# EAGLE design Rainbowduino_v2.0 (EAGLE 5.06)
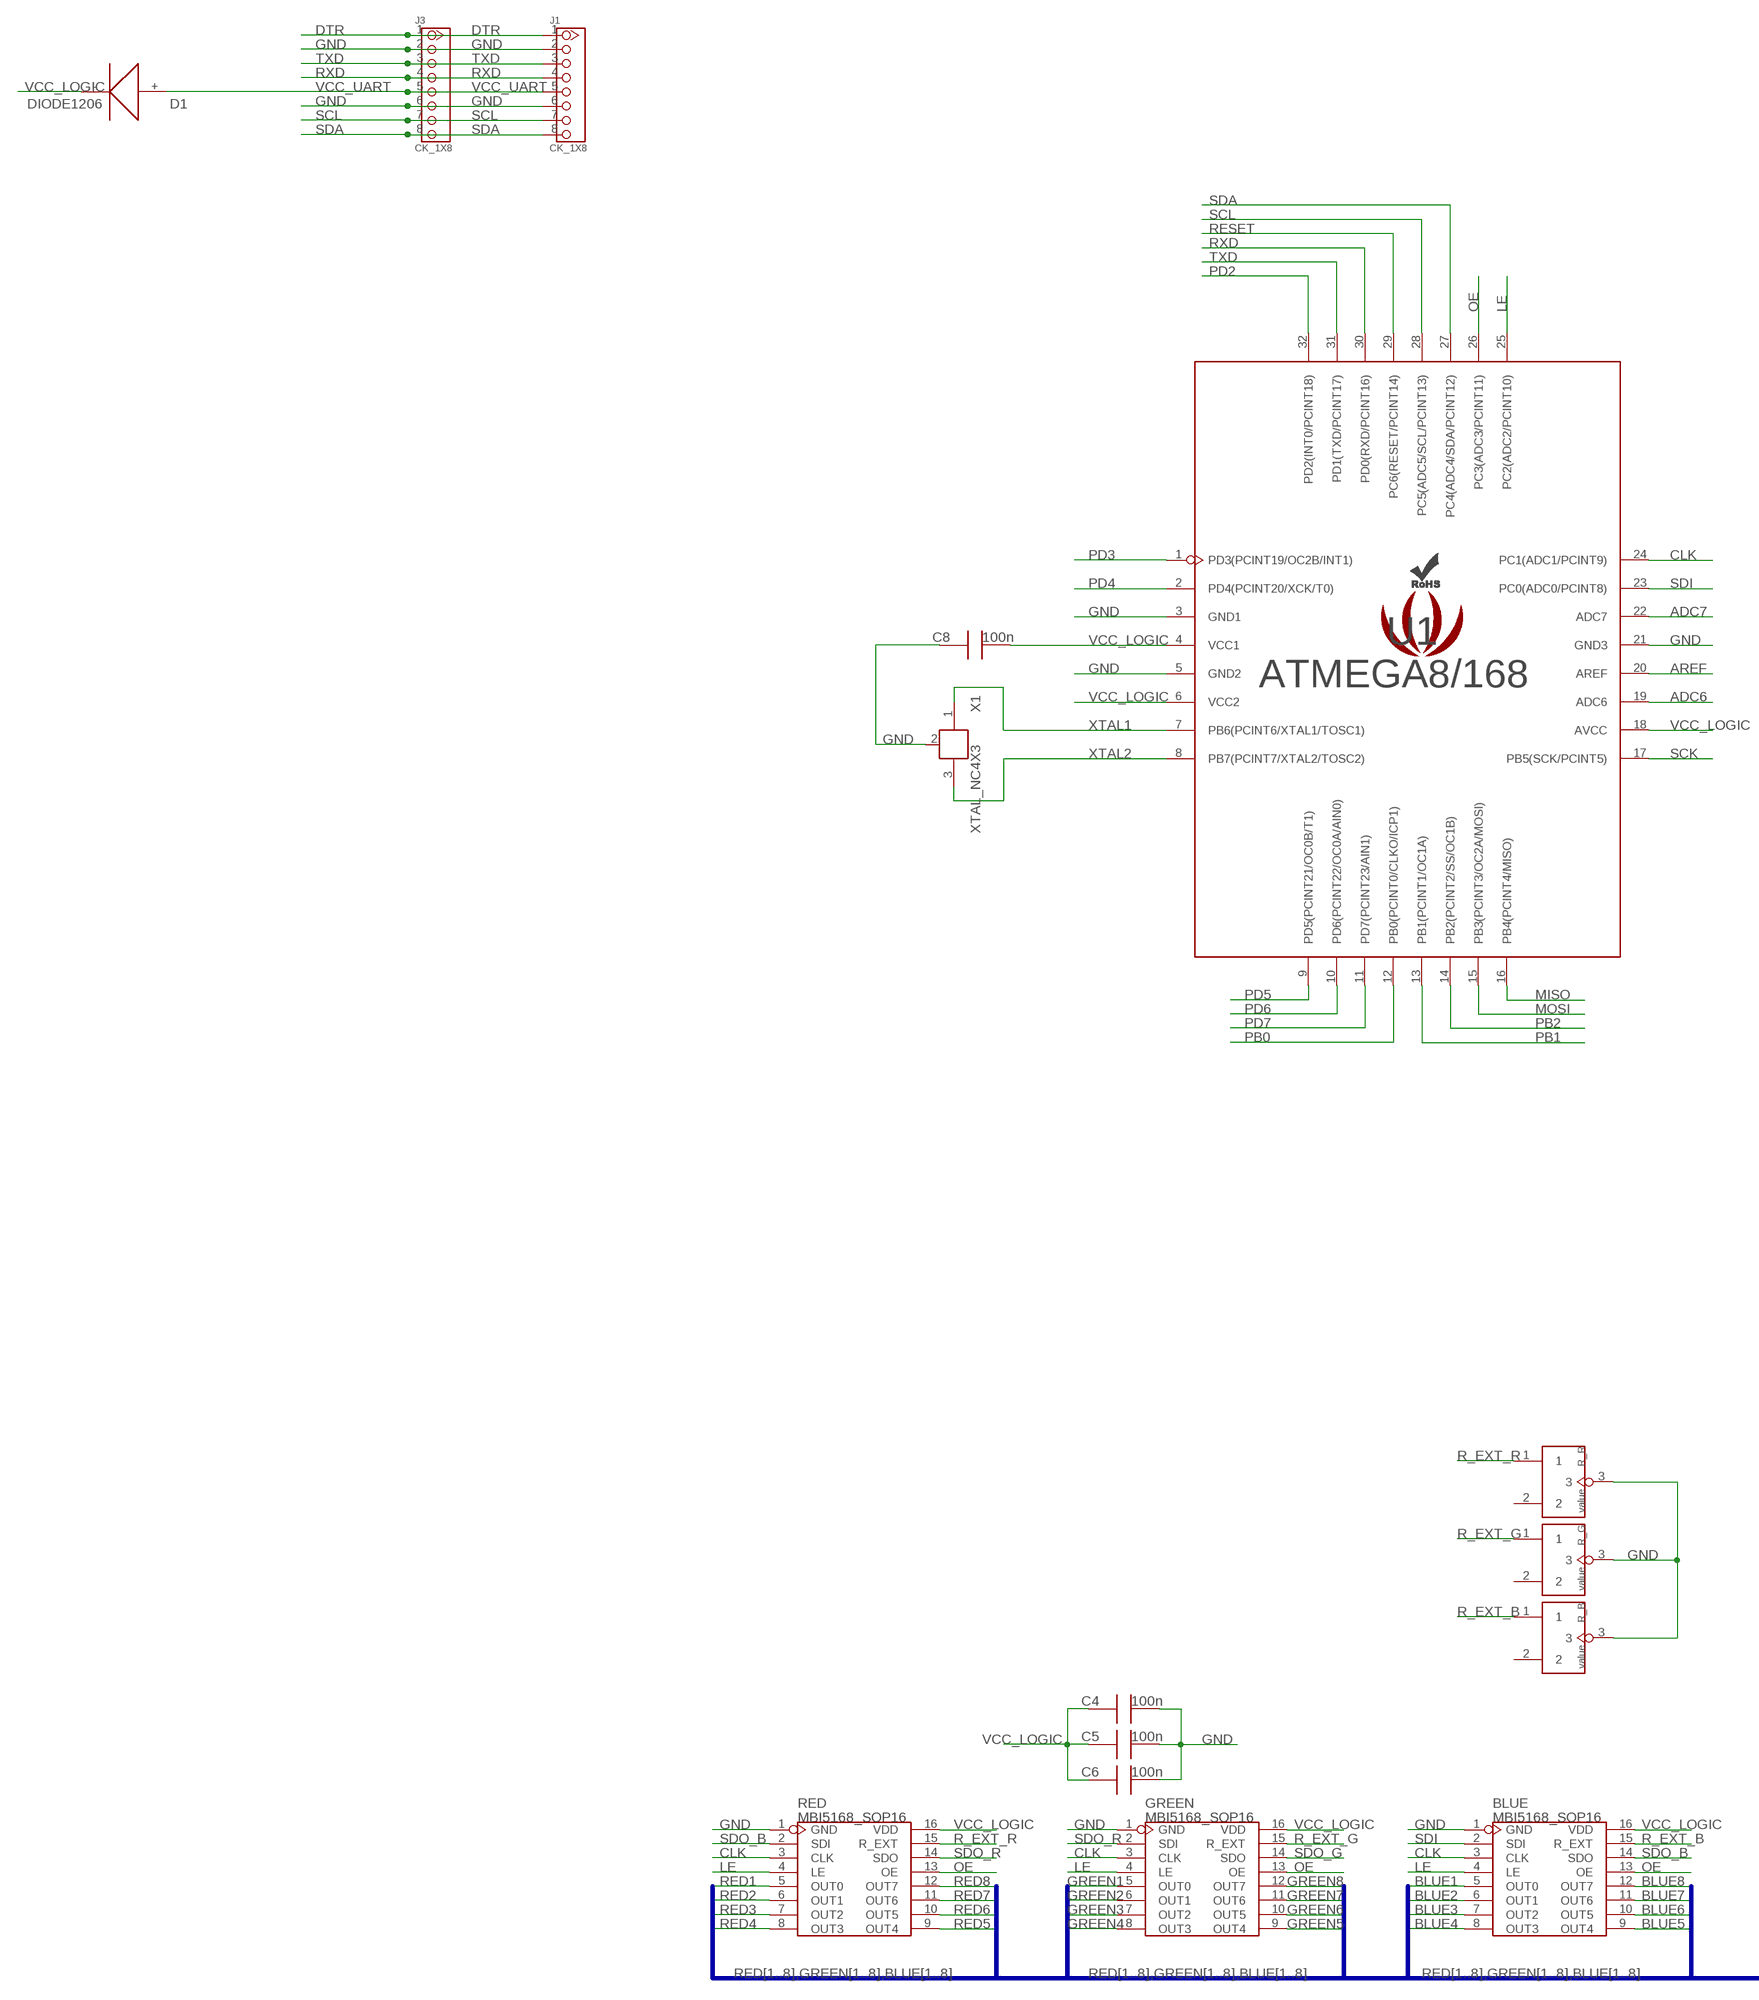
[diagram p0: schematic, sheet 1, part 1 of 2]
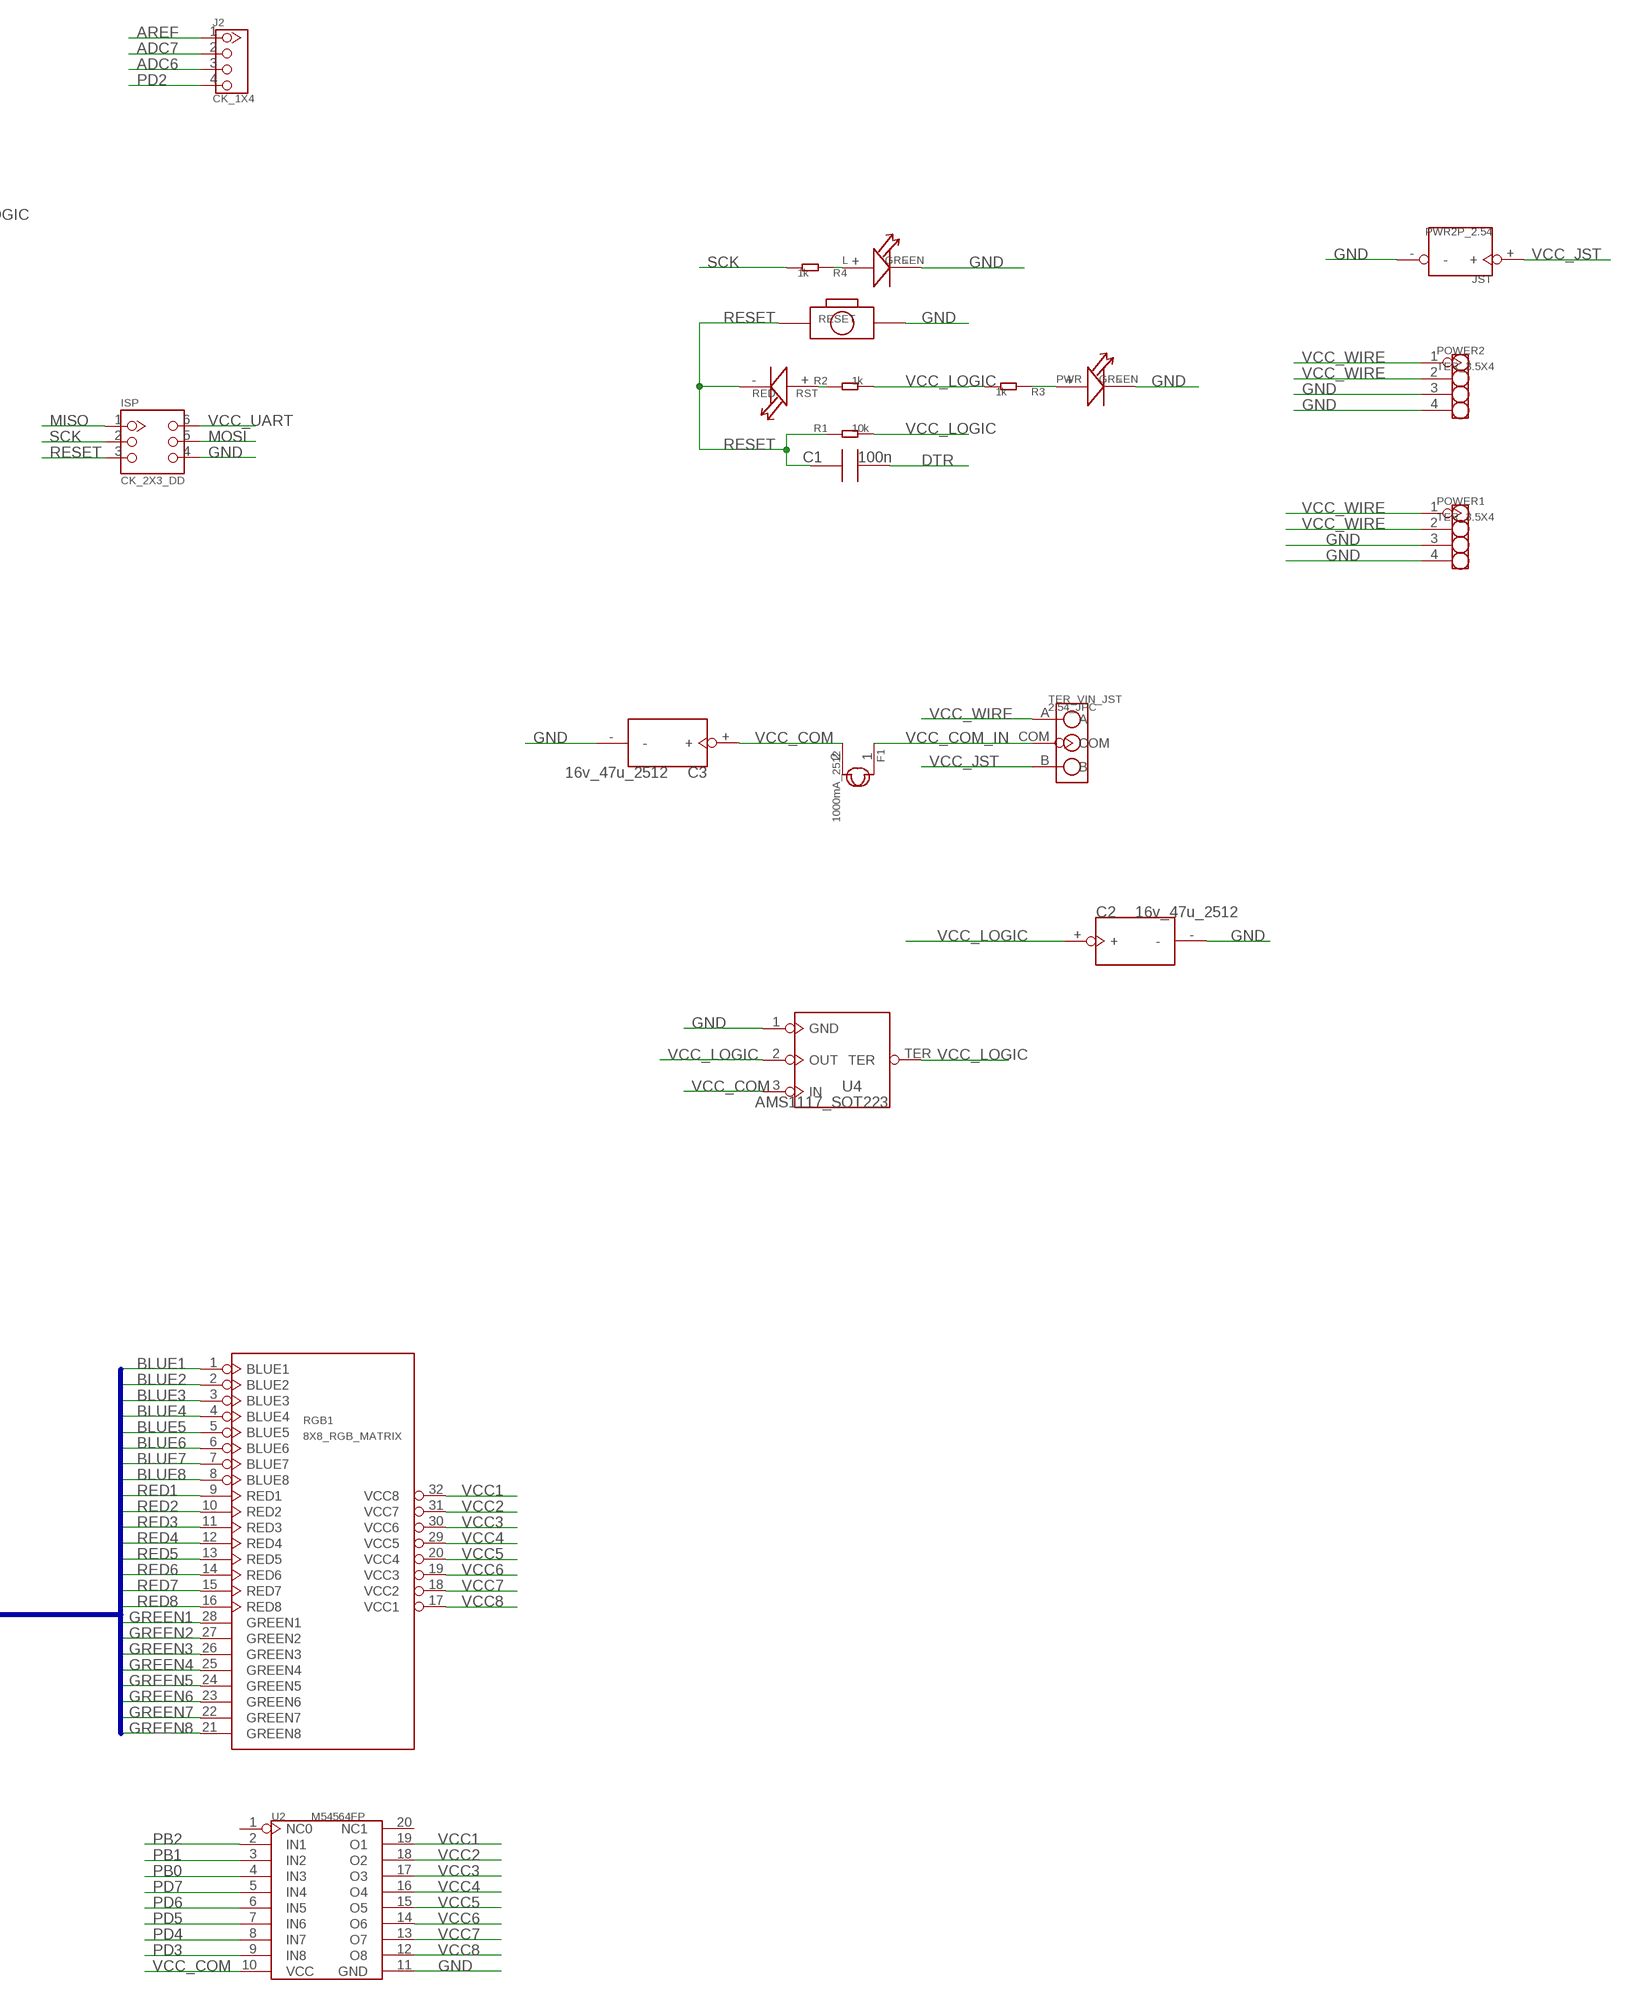
[diagram p1: schematic, sheet 1, part 2 of 2]

## Parts
BLUE  MBI5168_SOP16  [SO16_]
C1  100n  C0603  [0603]
C2  16v_47u_2512  CAP_SMD2512  [C_2512]
C3  16v_47u_2512  CAP_SMD2512  [C_2512]
C4  100n  C0603  [0603]
C5  100n  C0603  [0603]
C6  100n  C0603  [0603]
C8  100n  C0603  [0603]
D1  DIODE1206  [DIODE1206]
F1  1000mA_2512  FUSE_500MA2512  [2512]
GREEN  MBI5168_SOP16  [SO16_]
ISP  CK_2X3_DD  [CK_2X3]
J1  CK_1X8  [CK_1X8]
J2  CK_1X4  [CK_1X4]
J3  CK_1X8  [CK_1X8]
JST  PWR2P_2.54  [PWR_JST]
L  GREEN  LED0805  [LED0805]
LOGO1  ROHSSILK  [ROHS_SILK]
LOGO2  LOGO_COPPER200X166  [LOGO_COPPER]
POWER1  TER_3.5X4  [TER_3.5X4]
POWER2  TER_3.5X4  [TER_3.5X4]
PWR  GREEN  LED0805  [LED0805]
R1  10k  R0603  [0603]
R2  1k  R0603  [0603]
R3  1k  R0603  [0603]
R4  1k  R0603  [0603]
R_B  RP_XXX_DD  [R_ADJ]
R_G  RP_XXX_DD  [R_ADJ]
R_R  RP_XXX_DD  [R_ADJ]
RED  MBI5168_SOP16  [SO16_]
RESET  BOTTON_1_DP  [BTN_5.0_RST]
RGB1  8X8_RGB_MATRIX  [8X8_RGB_MATRIX]
RST  RED  LED0805  [LED0805]
TER_VIN_JST  2.54_JPC  [2.54_JP_C]
U1  ATMEGA8/168  ATMEGAXXX  [QFP32]
U2  M54564FP  [SOP20]
U4  AMS1117_SOT223  [SOT223]
X1  XTAL_NC4X3  [XTAL_4X3]

## Nets
ADC6: J2.3 U1.19(ADC6)
ADC7: J2.2 U1.22(ADC7)
AREF: J2.1 U1.20(AREF)
BLUE1: BLUE.5(OUT0) RGB1.1(BLUE1)
BLUE2: BLUE.6(OUT1) RGB1.2(BLUE2)
BLUE3: BLUE.7(OUT2) RGB1.3(BLUE3)
BLUE4: BLUE.8(OUT3) RGB1.4(BLUE4)
BLUE5: BLUE.9(OUT4) RGB1.5(BLUE5)
BLUE6: BLUE.10(OUT5) RGB1.6(BLUE6)
BLUE7: BLUE.11(OUT6) RGB1.7(BLUE7)
BLUE8: BLUE.12(OUT7) RGB1.8(BLUE8)
CLK: BLUE.3(CLK) GREEN.3(CLK) RED.3(CLK) U1.24(PC1(ADC1/PCINT9))
DTR: C1.2 J1.1 J3.1
GND: BLUE.1(GND) C2.- C3.- C4.2 C5.2 C6.2 C8.1 GREEN.1(GND) ISP.4 J1.2 J1.6 J3.2 J3.6 JST.- L.- POWER1.3 POWER1.4 POWER2.3 POWER2.4 PWR.- R_B.3 R_G.3 R_R.3 RED.1(GND) RESET.P$2 U1.3(GND1) U1.5(GND2) U1.21(GND3) U2.11(GND) U4.1(GND) X1.2(GND)
GREEN1: GREEN.5(OUT0) RGB1.28(GREEN1)
GREEN2: GREEN.6(OUT1) RGB1.27(GREEN2)
GREEN3: GREEN.7(OUT2) RGB1.26(GREEN3)
GREEN4: GREEN.8(OUT3) RGB1.25(GREEN4)
GREEN5: GREEN.9(OUT4) RGB1.24(GREEN5)
GREEN6: GREEN.10(OUT5) RGB1.23(GREEN6)
GREEN7: GREEN.11(OUT6) RGB1.22(GREEN7)
GREEN8: GREEN.12(OUT7) RGB1.21(GREEN8)
LE: BLUE.4(LE) GREEN.4(LE) RED.4(LE) U1.25(PC2(ADC2/PCINT10))
MISO: ISP.1 U1.16(PB4(PCINT4/MISO))
MOSI: ISP.5 U1.15(PB3(PCINT3/OC2A/MOSI))
N$1: R2.1 RST.+
N$2: PWR.+ R3.1
N$3: L.+ R4.1
OE: BLUE.13(OE) GREEN.13(OE) RED.13(OE) U1.26(PC3(ADC3/PCINT11))
PB0: U1.12(PB0(PCINT0/CLKO/ICP1)) U2.4(IN3)
PB1: U1.13(PB1(PCINT1/OC1A)) U2.3(IN2)
PB2: U1.14(PB2(PCINT2/SS/OC1B)) U2.2(IN1)
PD2: J2.4 U1.32(PD2(INT0/PCINT18))
PD3: U1.1(PD3(PCINT19/OC2B/INT1)) U2.9(IN8)
PD4: U1.2(PD4(PCINT20/XCK/T0)) U2.8(IN7)
PD5: U1.9(PD5(PCINT21/OC0B/T1)) U2.7(IN6)
PD6: U1.10(PD6(PCINT22/OC0A/AIN0)) U2.6(IN5)
PD7: U1.11(PD7(PCINT23/AIN1)) U2.5(IN4)
R_EXT_B: BLUE.15(R_EXT) R_B.1
R_EXT_G: GREEN.15(R_EXT) R_G.1
R_EXT_R: R_R.1 RED.15(R_EXT)
RED1: RED.5(OUT0) RGB1.9(RED1)
RED2: RED.6(OUT1) RGB1.10(RED2)
RED3: RED.7(OUT2) RGB1.11(RED3)
RED4: RED.8(OUT3) RGB1.12(RED4)
RED5: RED.9(OUT4) RGB1.13(RED5)
RED6: RED.10(OUT5) RGB1.14(RED6)
RED7: RED.11(OUT6) RGB1.15(RED7)
RED8: RED.12(OUT7) RGB1.16(RED8)
RESET: C1.1 ISP.3 R1.1 RESET.P$1 RST.- U1.29(PC6(RESET/PCINT14))
RXD: J1.4 J3.4 U1.30(PD0(RXD/PCINT16))
SCK: ISP.2 R4.2 U1.17(PB5(SCK/PCINT5))
SCL: J1.7 J3.7 U1.28(PC5(ADC5/SCL/PCINT13))
SDA: J1.8 J3.8 U1.27(PC4(ADC4/SDA/PCINT12))
SDI: BLUE.2(SDI) U1.23(PC0(ADC0/PCINT8))
SDO_B: BLUE.14(SDO) RED.2(SDI)
SDO_G: GREEN.14(SDO)
SDO_R: GREEN.2(SDI) RED.14(SDO)
TXD: J1.3 J3.3 U1.31(PD1(TXD/PCINT17))
VCC1: RGB1.32(VCC8) U2.19(O1)
VCC2: RGB1.31(VCC7) U2.18(O2)
VCC3: RGB1.30(VCC6) U2.17(O3)
VCC4: RGB1.29(VCC5) U2.16(O4)
VCC5: RGB1.20(VCC4) U2.15(O5)
VCC6: RGB1.19(VCC3) U2.14(O6)
VCC7: RGB1.18(VCC2) U2.13(O7)
VCC8: RGB1.17(VCC1) U2.12(O8)
VCC_COM: C3.+ F1.2 U2.10(VCC) U4.3(IN)
VCC_COM_IN: F1.1 TER_VIN_JST.COM
VCC_JST: JST.+ TER_VIN_JST.B
VCC_LOGIC: BLUE.16(VDD) C2.+ C4.1 C5.1 C6.1 C8.2 D1.- GREEN.16(VDD) R1.2 R2.2 R3.2 RED.16(VDD) U1.4(VCC1) U1.6(VCC2) U1.18(AVCC) U4.2(OUT) U4.TER
VCC_UART: D1.+ ISP.6 J1.5 J3.5
VCC_WIRE: POWER1.1 POWER1.2 POWER2.1 POWER2.2 TER_VIN_JST.A
XTAL1: U1.7(PB6(PCINT6/XTAL1/TOSC1)) X1.1
XTAL2: U1.8(PB7(PCINT7/XTAL2/TOSC2)) X1.3
Unconnected: R_B.2 R_G.2 R_R.2 U2.1(NC0) U2.20(NC1)

## Buses
RED[1..8],GREEN[1..8],BLUE[1..8]

## Library data of the parts
BLUE GREEN RED = ICs_v54:MBI5168
C1 C4-C6 C8 = CPT_SMD:C0603; C0603: 100N
C2 C3 = CPT_SMD:CAP_SMD
D1 = CPT_SMD:DIODE1206
F1 = CPT_SMD:FUSE_500MA
ISP = CONNECTER:CK_2X3
J1 J3 = CONNECTER:CK_1X8
J2 = CONNECTER:CK_1X4
JST = CONNECTER:PWR2P_2.54
L PWR RST = CPT_SMD:LED0805
LOGO1 = logo:ROHS
LOGO2 = logo:LOGO_COPPER
POWER1 POWER2 = CONNECTER:TER_3.5X4
R1-R4 = CPT_SMD:R0603
R_B R_G R_R = CPT_SMD:RP_XXX
RESET = CPT_SMD:BOTTON_1
RGB1 = EXT_moudle:8X8_RGB_MATRIX
TER_VIN_JST = CPT_CJ:2.54_JP
U1 = ICs_v54:ATMEGAXXX
U2 = ICs_v54:M54564FP
U4 = ICs_v54:AMS1117_SOT223
X1 = CPT_SMD:XTAL_NC

## Board
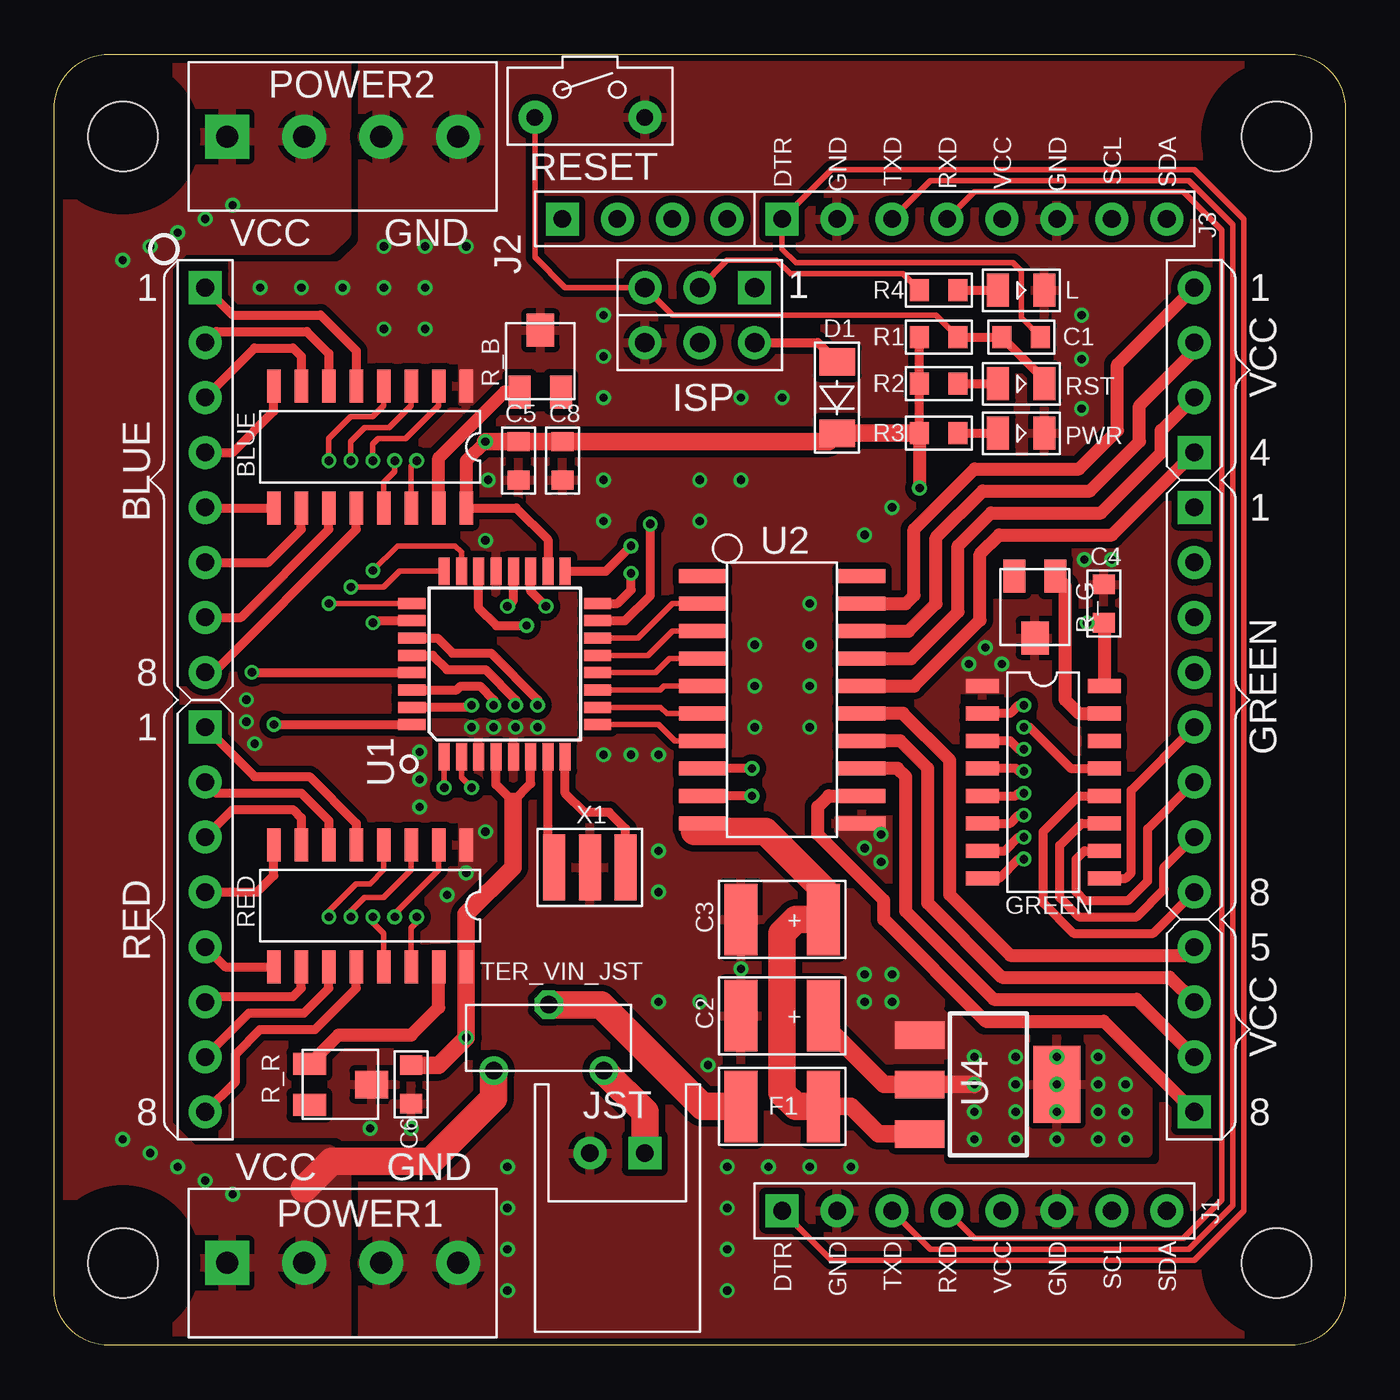
[diagram p2: board, top side]
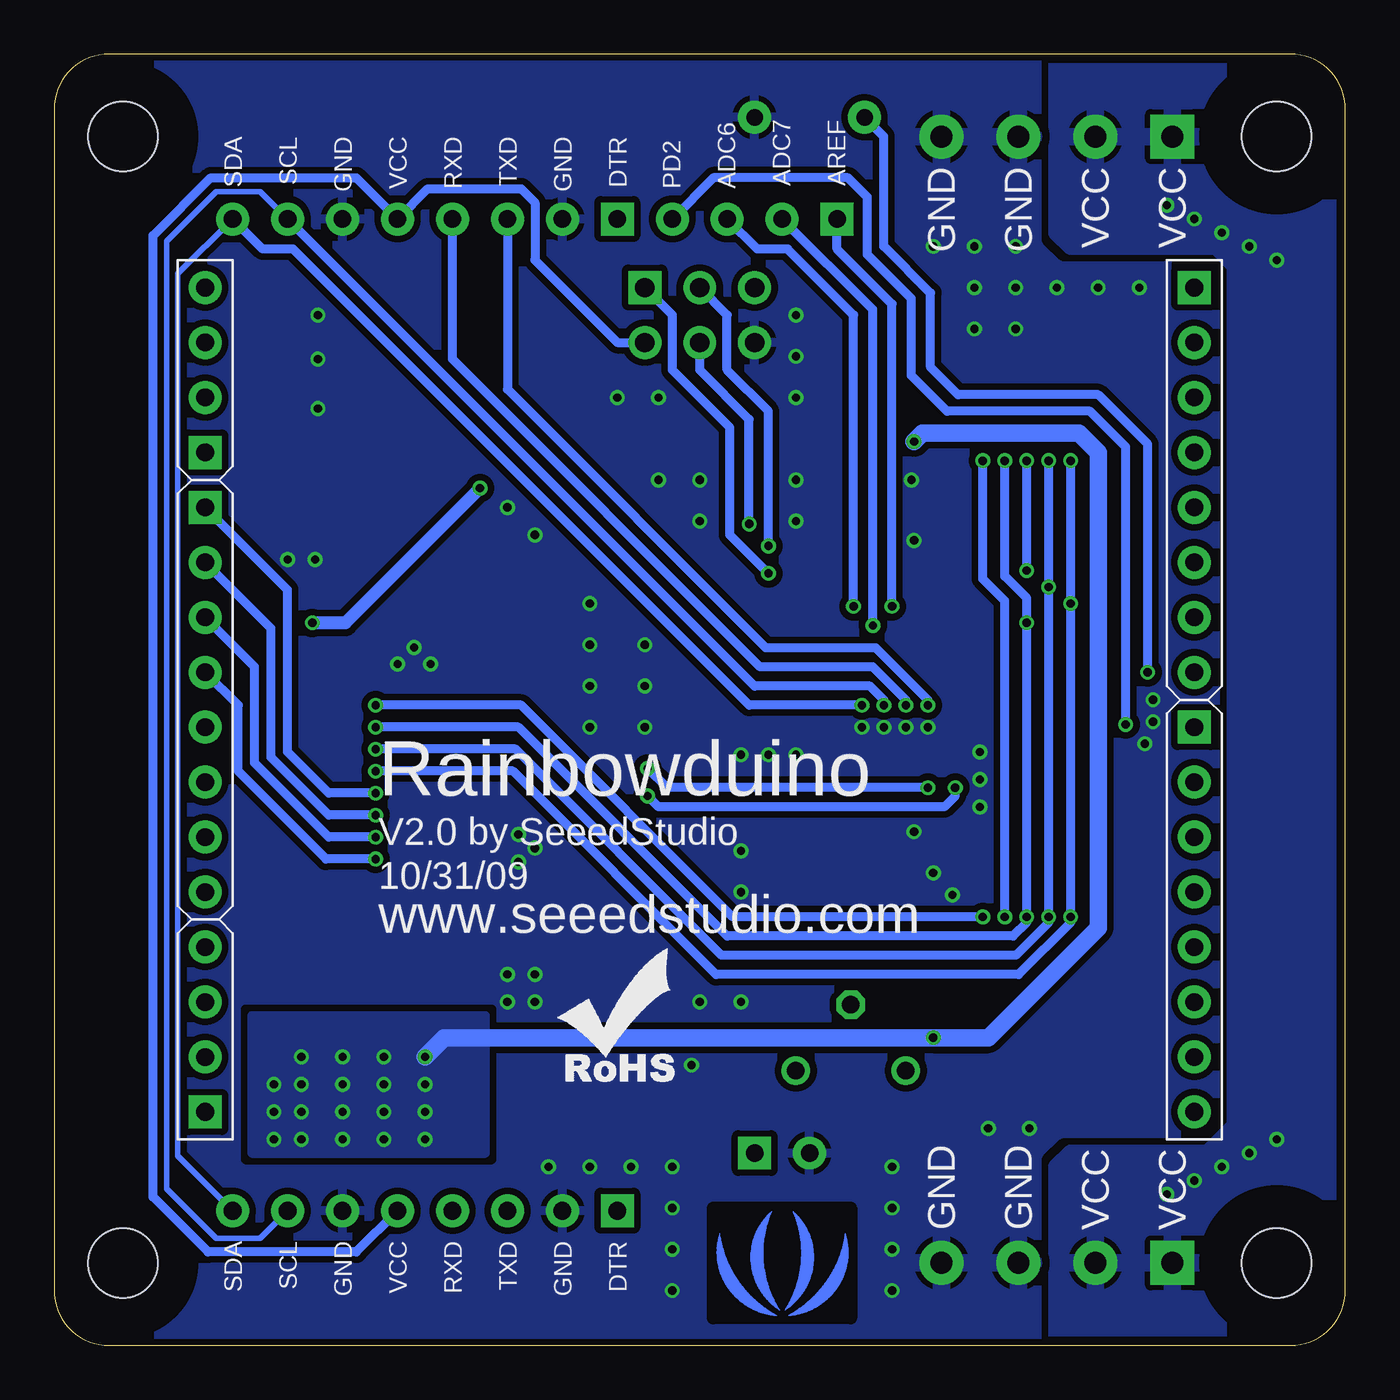
[diagram p3: board, bottom side, seen from below]

Size 59.69 x 59.69 mm. Coordinates in mm from the lower left corner, seen from the top.
Copper layers (1*16): Top 0.035mm / dielectric 1.5mm / Bottom 0.035mm
Design rules "SeeedStudio_rule_no_angle_090911": minimum track width 0.0025mm, minimum drill 10mil, track to track 6mil, track to pad 6mil, pad to pad 6mil, via to via 6mil, smd to smd 0mil, copper to edge 10mil, drill to drill 10mil, minimum pad ring 10mil, minimum via ring 6mil, stop-mask expansion 2mil, vias tented up to drill 100mil, thermal gap 10mil
Holes 3.2 mm at 3.17,55.88 56.52,55.88 56.52,3.81 3.17,3.81
tRestrict: area 0,52.7 to 6.3,59.1; area 0,0.6 to 6.3,7; area 53.3,0.6 to 59.7,7; area 53.3,52.7 to 59.7,59.1
bRestrict: area 0,52.7 to 6.3,59.1; area 0,0.6 to 6.3,7; area 53.3,0.6 to 59.7,7; area 53.3,52.7 to 59.7,59.1; area 22.9,1.3 to 29.2,6.3

### Footprints (pad centres in the part's own frame; a part is rotated, then mirrored left to right if it is on the bottom)
SO16_ = smd 0.635 x 1.524: 1 -4.445,-2.819; 2 -3.175,-2.819; 3 -1.905,-2.819; 4 -0.635,-2.819; 5 0.635,-2.819; 6 1.905,-2.819; 7 3.175,-2.819; 8 4.445,-2.819; 9 4.445,2.819; 10 3.175,2.819; 11 1.905,2.819; 12 0.635,2.819; 13 -0.635,2.819; 14 -1.905,2.819; 15 -3.175,2.819; 16 -4.445,2.819
0603 = smd 0.889 x 1.016: 1 -0.889,0; 2 0.889,0
C_2512 = smd 1.524 x 3.302: + -1.905,0; - 1.905,0
DIODE1206 = smd 1.27 x 1.651: + -1.651,0; - 1.651,0
2512 = smd 1.524 x 3.302: 1 -1.905,0; 2 1.905,0
CK_2X3 = drill 0.889 pad 1.524 square: 1 -1.27,2.54 | drill 0.889 pad 1.524 round: 2 -1.27,0; 3 -1.27,-2.54; 4 1.27,-2.54; 5 1.27,0; 6 1.27,2.54
CK_1X8 = drill 0.813 pad 1.524 square: 1 0,8.89 | drill 0.813 pad 1.524 round: 2 0,6.35; 3 0,3.81; 4 0,1.27; 5 0,-1.27; 6 0,-3.81; 7 0,-6.35; 8 0,-8.89
CK_1X4 = drill 0.813 pad 1.524 square: 1 0,3.81 | drill 0.813 pad 1.524 round: 2 0,1.27; 3 0,-1.27; 4 0,-3.81
PWR_JST = drill 0.813 pad 1.524 square: + 0,-1.27 | drill 0.813 pad 1.524 round: - 0,1.27
LED0805 = smd 1.016 x 1.524: + -1.077,0; - 1.077,0
TER_3.5X4 = drill 1.016 pad 2.032 square: 1 0,5.334 | drill 1.016 pad 2.032 round: 2 0,1.778; 3 0,-1.778; 4 0,-5.334
R_ADJ = smd 1.016 x 1.524: 1 -0.953,-1.27; 2 0.953,-1.27 | smd 1.27 x 1.524: 3 0,1.587
BTN_5.0_RST = drill 0.762 pad 1.524 round: P$1 0,2.54; P$2 0,-2.54
8X8_RGB_MATRIX = drill 0.813 pad 1.524 square: 1 6.985,48.895; 9 6.985,28.575; 17 52.705,10.795; 28 52.705,38.735; 29 52.705,41.275 | drill 0.813 pad 1.524 round: 2 6.985,46.355; 3 6.985,43.815; 4 6.985,41.275; 5 6.985,38.735; 6 6.985,36.195; 7 6.985,33.655; 8 6.985,31.115; 10 6.985,26.035; 11 6.985,23.495; 12 6.985,20.955; 13 6.985,18.415; 14 6.985,15.875; 15 6.985,13.335; 16 6.985,10.795; 18 52.705,13.335; 19 52.705,15.875; 20 52.705,18.415; 21 52.705,20.955; 22 52.705,23.495; 23 52.705,26.035; 24 52.705,28.575; 25 52.705,31.115; 26 52.705,33.655; 27 52.705,36.195; 30 52.705,43.815; 31 52.705,46.355; 32 52.705,48.895
2.54_JP_C = drill 0.813 round: A -1.27,2.54; B -1.27,-2.54 | drill 0.813 octagon: COM 1.778,0
QFP32 = smd 1.27 x 0.508: 1 -4.293,2.8; 2 -4.293,2; 3 -4.293,1.2; 4 -4.293,0.4; 5 -4.293,-0.4; 6 -4.293,-1.2; 7 -4.293,-2; 8 -4.293,-2.8; 17 4.293,-2.8; 18 4.293,-2; 19 4.293,-1.2; 20 4.293,-0.4; 21 4.293,0.4; 22 4.293,1.2; 23 4.293,2; 24 4.293,2.8 | smd 0.508 x 1.27: 9 -2.8,-4.293; 10 -2,-4.293; 11 -1.2,-4.293; 12 -0.4,-4.293; 13 0.4,-4.293; 14 1.2,-4.293; 15 2,-4.293; 16 2.8,-4.293; 25 2.8,4.293; 26 2,4.293; 27 1.2,4.293; 28 0.4,4.293; 29 -0.4,4.293; 30 -1.2,4.293; 31 -2,4.293; 32 -2.8,4.293
SOP20 = smd 2.159 x 0.635: 1 -3.683,5.715; 2 -3.683,4.445; 3 -3.683,3.175; 4 -3.683,1.905; 5 -3.683,0.635; 6 -3.683,-0.635; 7 -3.683,-1.905; 8 -3.683,-3.175; 9 -3.683,-4.445; 10 -3.683,-5.715; 11 3.683,-5.715; 12 3.683,-4.445; 13 3.683,-3.175; 14 3.683,-1.905; 15 3.683,-0.635; 16 3.683,0.635; 17 3.683,1.905; 18 3.683,3.175; 19 3.683,4.445; 20 3.683,5.715
SOT223 = smd 1.27 x 2.286: 1 -2.286,-3.175; 2 0,-3.175; 3 2.286,-3.175 | smd 3.556 x 2.159: TER 0,3.175
XTAL_4X3 = smd 1.016 x 3.048: 1 -1.651,0; 2 0,0; 3 1.651,0

### Placement (x,y rotation side)
BLUE  14.61,41.53 180 top
C1  44.7,46.61 0 top
C2  33.66,15.24 180 top
C3  33.66,19.68 180 top
C4  48.51,34.29 90 top
C5  21.46,40.89 270 top
C6  16.51,12.06 270 top
C8  23.5,40.89 90 top
D1  36.2,43.81 270 top
F1  33.66,11.05 0 top
GREEN  45.72,26.04 270 top
ISP  29.84,47.62 270 top
J1  42.55,6.22 90 top
J2  27.3,52.07 90 top
J3  42.55,52.07 90 top
JST  26.04,8.89 90 top
L  44.7,48.77 0 top
LOGO1  34.29,14.61 0 bottom
LOGO2  26.04,3.05 0 bottom
POWER1  13.34,3.81 90 top
POWER2  13.34,55.88 90 top
PWR  44.7,42.16 0 top
R1  40.89,46.61 180 top
R2  40.89,44.45 180 top
R3  40.89,42.16 180 top
R4  40.89,48.77 180 top
R_B  22.48,45.34 0 top
R_G  45.34,34.29 180 top
R_R  13.08,12.06 270 top
RED  14.61,20.32 180 top
RESET  24.77,56.77 90 top
RGB1  0,0 0 top
RST  44.7,44.45 0 top
TER_VIN_JST  22.86,13.97 90 top
U1  20.83,31.5 90 top
U2  33.66,29.84 0 top
U4  43.18,12.06 270 top
X1  24.77,22.1 0 top

### Tracks (layer width: path | path; a pad name or v marks a point on that pad's centre or on a via)
ADC6  (via drill 0.38)
  Top 0.406: U1.19 22.03,34.87 v22.73,34.16
  Bottom 0.406: J2.3 27.18,50.67 25.78,50.67 22.73,47.62 v22.73,34.16
ADC7  (via drill 0.38)
  Top 0.406: U1.22 19.63,34.09 20.45,33.27 v21.84,33.27
  Bottom 0.406: J2.2 21.84,47.88 v21.84,33.27
AREF  (via drill 0.38)
  Top 0.406: U1.20 21.23,34.44 v20.95,34.16
  Bottom 0.406: J2.1 23.5,50.67 20.95,48.13 v20.95,34.16
BLUE1
  Top 0.406: BLUE.5 13.97,45.97 12.32,47.62 8.26,47.62 RGB1.1
BLUE2
  Top 0.406: BLUE.6 12.7,45.85 11.68,46.86 7.49,46.86 RGB1.2
BLUE3
  Top 0.406: BLUE.7 11.43,45.72 11.05,46.1 9.27,46.1 RGB1.3
BLUE4
  Top 0.406: BLUE.8 10.16,43.18 8.26,41.27 RGB1.4
BLUE5
  Top 0.406: BLUE.9 7.01,38.71 RGB1.5
BLUE6
  Top 0.406: BLUE.10 11.43,37.72 9.91,36.2 RGB1.6
BLUE7
  Top 0.406: BLUE.11 12.7,37.72 8.64,33.66 RGB1.7
BLUE8
  Top 0.406: BLUE.12 13.97,37.72 7.37,31.11 RGB1.8
CLK  (via drill 0.38)
  Top 0.254: U1.24 15.98,35.79 15.24,35.05 v13.72,35.05 | BLUE.3 16.51,43.43 15.49,42.42 14.35,42.42 13.72,41.78 v13.72,40.89 | v13.72,19.81 13.72,20.07 14.35,20.7 15.24,20.7 16.51,21.97 RED.3
  Top 0.406: GREEN.3 44.2,27.94 44.58,27.56 v44.83,27.56
  Bottom 0.406: v13.72,40.89 v13.72,35.05 v13.72,19.81 13.72,19.56 15.24,18.03 28.83,18.03 38.35,27.56 v44.83,27.56
DTR
  Top 0.254: J1.1 35.94,3.94 52.7,3.94 54.99,6.22 54.99,52.07 52.7,54.36 35.94,54.36 J3.1 33.66,50.67 34.29,50.04 44.32,50.04 44.7,49.66 44.7,47.5 C1.2
GND  (via drill 0.38)
  other vias: 37.47,22.99 38.23,23.62 38.23,22.35 37.47,17.14 37.47,15.88 38.73,15.88 43.05,32.26 42.29,31.5 43.81,31.5 47.5,43.31 47.5,45.59 47.5,47.62 19.05,21.84 18.16,20.83 19.94,23.75 16.89,24.89 16.89,26.16 16.89,27.43 20.32,28.57 21.34,28.57 22.35,28.57 19.3,28.57 19.94,37.21 20.07,40.01 9.27,27.81 8.89,28.83 8.89,29.84 16.51,10.03 14.61,10.03 38.73,17.14 15.24,46.99 17.14,46.99 17.14,48.9 15.24,48.9 13.34,48.9 11.43,48.9 9.53,48.9 15.24,50.8 17.14,50.8 19.05,50.8 25.4,47.62 25.4,45.72 25.4,43.81 31.75,43.81 33.66,43.81 31.75,40.01 29.84,40.01 29.84,38.1 25.4,40.01 25.4,38.1 38.73,38.73 34.92,34.29 34.92,32.38 32.38,32.38 32.38,30.48 34.92,30.48 32.38,28.57 34.92,28.57 27.94,22.86 27.94,20.95 29.84,15.88 27.94,15.88 36.83,8.26 34.92,8.26 33.02,8.26 31.11,8.26 31.11,6.35 31.11,4.45 31.11,2.54 20.95,8.26 20.95,6.35 20.95,4.45 20.95,2.54 30.23,12.95 31.75,17.4 25.4,27.3 26.67,27.3 27.94,27.3 37.47,37.47 47.62,36.32 48.9,36.32
  pour Bottom (isolate 0.305, rank 6): 0,59.69 59.69,59.69 59.69,0 0,0
  pour Top (isolate 0.305, rank 6): 0,59.69 59.69,59.69 59.69,0 0,0
  pour Top (isolate 0.406, rank 5): 20.95,6.99 20.95,0 13.34,0 13.34,6.99
  pour Top (isolate 0.406, rank 5): 13.34,59.69 20.95,59.69 20.95,52.7 13.34,52.7
  pour Bottom (isolate 0.406, rank 5): 13.34,59.69 13.34,52.7 20.95,52.7 20.95,59.69
  pour Bottom (isolate 0.406, rank 5): 20.95,6.99 20.95,0 13.34,0 13.34,6.99
  pour Top (isolate 0.305, no thermals): 36.2,24.38 38.86,24.38 38.86,22.99 36.2,22.99
  pour Top (rank 6, no thermals): 37.47,15.88 40.64,15.88 41.27,15.24 41.27,13.34 38.35,13.34 37.47,14.22
  pour Top (isolate 0.305, rank 6, no thermals): 41.91,31.37 44.07,31.37 44.07,30.23 41.91,30.23
  pour Top (isolate 0.305, rank 6, no thermals): 18.8,24.51 19.94,24.51 19.94,22.1 18.8,22.1
  pour Top (isolate 0.305, rank 6, no thermals): 18.8,45.72 19.94,45.72 19.94,43.56 18.8,43.56
GREEN1  (via drill 0.38)
  Top 0.406: GREEN.5 44.45,25.4 44.58,25.53 v44.83,25.53
  Bottom 0.406: RGB1.28 48.9,34.92 48.9,27.43 46.99,25.53 v44.83,25.53
GREEN2  (via drill 0.38)
  Top 0.406: GREEN.6 44.2,24.13 44.58,24.51 v44.83,24.51
  Bottom 0.406: RGB1.27 49.66,33.15 49.66,27.18 46.99,24.51 v44.83,24.51
GREEN3  (via drill 0.38)
  Top 0.406: GREEN.7 43.94,22.86 44.58,23.5 v44.83,23.5
  Bottom 0.406: RGB1.26 50.42,31.37 50.42,26.92 46.99,23.5 v44.83,23.5
GREEN4  (via drill 0.38)
  Top 0.406: GREEN.8 43.69,21.59 44.58,22.48 v44.83,22.48
  Bottom 0.406: RGB1.25 51.18,29.59 51.18,26.54 47.12,22.48 v44.83,22.48
GREEN5
  Top 0.406: GREEN.9 49.53,21.59 49.78,21.84 49.78,25.65 RGB1.24
GREEN6
  Top 0.406: GREEN.10 47.62,22.86 47.24,22.48 47.24,20.95 47.62,20.57 49.66,20.57 50.55,21.46 50.55,23.88 RGB1.23
GREEN7
  Top 0.406: GREEN.11 47.5,24.13 46.48,23.11 46.48,20.7 47.37,19.81 50.04,19.81 51.31,21.08 51.31,22.1 RGB1.22
GREEN8
  Top 0.406: GREEN.12 47.37,25.4 45.72,23.75 45.72,20.45 47.12,19.05 50.8,19.05 RGB1.21
LE  (via drill 0.38)
  Top 0.254: U1.25 v12.71,34.3 v12.7,34.29 | BLUE.4 15.24,43.43 14.73,42.93 13.72,42.93 12.7,41.91 v12.7,40.89 | v12.7,19.81 12.7,20.07 13.97,21.34 14.61,21.34 15.24,21.97 RED.4
  Top 0.406: GREEN.4 44.45,26.67 44.58,26.54 v44.83,26.54
  Bottom 0.406: v12.7,40.89 v12.7,34.29 v12.7,19.81 12.7,19.56 15.11,17.14 29.08,17.14 38.48,26.54 v44.83,26.54
MISO  (via drill 0.38)
  Top 0.406: U1.16 26.04,34.3 26.67,34.92 v26.67,35.69
  Bottom 0.406: v26.67,35.69 28.45,37.47 28.45,42.42 31.11,45.09 31.11,47.62 ISP.1
MOSI  (via drill 0.38)
  Top 0.406: U1.15 26.38,33.5 27.56,34.67 v27.56,37.97
  Bottom 0.406: v27.56,37.97 27.56,42.8 29.84,45.09 ISP.5
N$1
  Top 0.406: R2.1 RST.+
N$2
  Top 0.406: R3.1 PWR.+
N$3
  Top 0.406: R4.1 L.+
OE  (via drill 0.38)
  Top 0.254: BLUE.13 15.24,39.88 15.75,40.39 v15.75,40.89 | RED.13 15.24,19.05 14.73,19.56 v14.73,19.81
  Top 0.406: U1.26 15.08,33.5 v14.73,33.4 | GREEN.13 46.99,26.67 45.09,28.57 v44.83,28.57
  Bottom 0.406: v15.75,40.89 15.75,35.56 14.73,34.54 v14.73,33.4 v14.73,19.81 14.73,19.56 15.37,18.92 28.57,18.92 38.23,28.57 v44.83,28.57
PB0
  Top 0.254: U1.12 27.79,31.1 28.45,31.75 U2.4
PB1
  Top 0.254: U1.13 27.45,31.9 28.57,33.02 U2.3
PB2
  Top 0.254: U1.14 26.98,32.7 28.57,34.29 U2.2
PD2  (via drill 0.38)
  Top 0.406: U1.32 v10.17,28.7 v10.16,28.7
  Bottom 0.406: v10.16,28.7 10.16,41.53 11.81,43.18 18.41,43.18 20.07,44.83 20.07,48.39 22.1,50.42 22.1,53.09 22.99,53.98 29.21,53.98 J2.4
PD3  (via drill 0.38)
  Top 0.254: U1.1 v18.03,25.79 v18.03,25.78
  Top 0.406: v32.26,25.4 U2.9
  Bottom 0.406: v18.03,25.78 18.03,25.4 18.54,24.89 31.75,24.89 v32.26,25.4
PD4  (via drill 0.38)
  Top 0.254: U1.2 18.83,26.26 v19.3,25.78
  Top 0.406: v32.26,26.67 U2.8
  Bottom 0.406: v19.3,25.78 31.37,25.78 v32.26,26.67
PD5
  Top 0.254: U1.9 27.95,28.7 28.7,27.94 U2.7
PD6
  Top 0.254: U1.10 28.04,29.5 28.32,29.21 U2.6
PD7
  Top 0.254: U1.11 28.01,30.3 28.19,30.48 U2.5
R_EXT_B
  Top 0.61: BLUE.15 17.78,41.02 20.83,44.07 R_B.1
R_EXT_G
  Top 0.61: GREEN.15 47.37,29.21 46.74,29.84 46.74,35.12 R_G.1
R_EXT_R
  Top 0.61: RED.15 17.78,15.62 16.51,14.35 13.14,14.35 R_R.1
RED1
  Top 0.406: RED.5 13.97,24.13 11.81,26.29 9.27,26.29 RGB1.9
RED2
  Top 0.406: RED.6 12.7,24.26 11.43,25.53 7.49,25.53 RGB1.10
RED3
  Top 0.406: RED.7 11.43,24.38 11.05,24.77 8.26,24.77 RGB1.11
RED4
  Top 0.406: RED.8 10.16,21.72 9.4,20.95 RGB1.12
RED5
  Top 0.406: RED.9 7.9,17.5 RGB1.13
RED6
  Top 0.406: RED.10 11.43,16.51 11.05,16.13 7.24,16.13 RGB1.14
RED7
  Top 0.406: RED.11 12.7,16.51 11.56,15.37 9.02,15.37 RGB1.15
RED8
  Top 0.406: RED.12 13.97,16.51 12.06,14.61 9.53,14.61 8.38,13.46 8.38,12.19 RGB1.16
RESET  (via drill 0.38)
  Top 0.254: RESET.P$1 22.23,50.29 23.62,48.9 ISP.3 28.57,47.62 40.77,47.62 R1.1
  Top 0.406: R1.1 C1.1 45.78,44.64 RST.- | U1.29 9.16,31.1 v9.14,31.11
  Bottom 0.406: v9.14,31.11 9.14,41.66 11.43,43.94 17.91,43.94 19.18,45.21 19.18,48.64 21.34,50.8 21.34,55.88 RESET.P$1
RXD  (via drill 0.38)
  Top 0.254: J1.4 42.55,4.95 52.2,4.95 53.98,6.73 53.98,51.56 52.2,53.34 42.55,53.34 J3.4
  Top 0.406: U1.30 18.61,30.3 18.8,30.48 19.68,30.48 20.32,29.84 v20.32,29.59
  Bottom 0.406: J3.4 41.27,45.59 27.05,31.37 21.84,31.37 20.32,29.84 v20.32,29.59
SCK  (via drill 0.38)
  Top 0.254: ISP.2 31.11,50.16 33.4,50.16 34.04,49.53 39.24,49.53 R4.2
  Top 0.406: U1.17 25.5,35.79 v26.67,36.96
  Bottom 0.406: v26.67,36.96 26.67,43.18 28.57,45.09 28.57,47.62 ISP.2
SCL  (via drill 0.38)
  Top 0.406: v21.34,29.59 21.34,29.84 19.94,31.24 18.16,31.24 17.51,31.9 U1.28
  Bottom 0.254: J1.7 50.16,4.95 52.2,4.95 54.48,7.24 54.48,51.05 52.2,53.34 50.16,53.34 J3.7
  Bottom 0.406: J3.7 27.3,30.48 21.97,30.48 21.34,29.84 v21.34,29.59
SDA  (via drill 0.38)
  Top 0.406: v22.35,29.59 22.35,29.84 20.19,32 18.41,32 17.72,32.7 U1.27
  Bottom 0.254: J1.8 53.98,8.76 53.98,49.53 J3.8
  Bottom 0.406: J3.8 50.04,50.67 48.64,50.67 27.56,29.59 v22.35,29.59
SDI  (via drill 0.38)
  Top 0.254: U1.23 18.83,36.67 18.54,36.96 15.88,36.96 v14.73,35.81 | BLUE.2 17.78,43.43 16.26,41.91 14.99,41.91 14.73,41.66 v14.73,40.89
  Bottom 0.406: v14.73,35.81 v14.73,40.89
SDO_B  (via drill 0.38)
  Top 0.254: BLUE.14 16.51,40.64 v16.76,40.89 | v15.75,19.81 15.75,19.94 17.78,21.97 RED.2
  Bottom 0.406: v15.75,19.81 15.75,34.42 16.76,35.43 v16.76,40.89
SDO_R  (via drill 0.38)
  Top 0.254: RED.14 16.51,19.3 16.76,19.56 v16.76,19.81
  Top 0.406: GREEN.2 44.2,29.21 44.58,29.59 v44.83,29.59
  Bottom 0.406: v16.76,19.81 28.32,19.81 38.1,29.59 v44.83,29.59
TXD  (via drill 0.38)
  Top 0.254: J1.3 40.51,4.45 52.45,4.45 54.48,6.48 54.48,51.82 52.45,53.85 40.51,53.85 J3.3
  Top 0.406: U1.31 19.21,29.5 v19.3,29.59
  Bottom 0.406: J3.3 38.73,44.2 26.8,32.26 21.72,32.26 19.3,29.84 v19.3,29.59
VCC1
  Top 0.61: U2.19 39.37,34.29 39.75,34.67 39.75,37.72 42.55,40.51 47.37,40.51 49.15,42.29 49.15,45.34 RGB1.32
VCC2
  Top 0.61: U2.18 39.5,33.02 40.77,34.29 40.77,37.34 42.93,39.5 47.88,39.5 50.16,41.78 50.16,43.43 52.7,45.97 RGB1.31
VCC3
  Top 0.61: U2.17 39.62,31.75 41.78,33.91 41.78,36.96 43.31,38.48 48.39,38.48 51.18,41.27 51.18,42.29 RGB1.30
VCC4
  Top 0.61: U2.16 39.75,30.48 42.8,33.53 42.8,36.58 43.69,37.47 48.9,37.47 RGB1.29
VCC5
  Top 0.61: RGB1.20 52.32,18.03 44.2,18.03 41.4,20.83 41.4,27.05 39.24,29.21 U2.15
VCC6
  Top 0.61: RGB1.19 51.56,17.02 43.81,17.02 40.39,20.45 40.39,26.67 39.12,27.94 U2.14
VCC7
  Top 0.61: U2.13 38.99,26.67 39.37,26.29 39.37,20.07 43.43,16 50.04,16 RGB1.18
VCC8
  Top 0.61: U2.12 35.81,25.4 35.31,24.89 35.31,23.62 38.35,20.57 38.35,19.68 43.05,14.99 48.51,14.99 RGB1.17
VCC_COM
  Top 0.61: 29.97,23.75 U2.10
  Top 0.813: U4.3 38.1,9.78 36.83,11.05 F1.2
  Top 1.27: F1.2 34.29,11.05 33.66,11.68 33.66,19.05 34.29,19.68 C3.+ 35.56,21.08 32.89,23.75 29.97,23.75 29.59,23.75
VCC_COM_IN
  Top 1.27: TER_VIN_JST.COM 25.27,15.75 29.97,11.05 F1.1
VCC_JST
  Top 1.27: JST.+ 27.3,10.79 TER_VIN_JST.B
VCC_LOGIC  (via drill 0.38)
  Top 0.406: R1.2 R2.2 R3.2 | U1.6 22.03,25.96 21.21,25.15 20.43,25.93 U1.4 | C4.1 48.54,33.38 | BLUE.16 21.36,38.71 22.83,37.24 U1.18
  Top 0.61: 48.54,33.38 GREEN.16 | BLUE.16 19.05,40.89 v19.94,41.78 | R3.2 v40.01,39.62 | v47.75,33.4 C4.1
  Top 0.813: C2.+ 35.56,14.86 38.35,12.06 U4.2 v42.55,12.06 | 21.21,25.15 21.21,22.1 19.05,19.94 RED.16 v19.05,14.22 17.78,12.95 C6.1 | v19.94,41.78 C5.1 C8.2 35.81,41.78 D1.- R3.2
  Bottom 0.61: v40.01,39.62 46.23,33.4 v47.75,33.4
  Bottom 0.813: v19.94,41.78 19.56,42.16 12.32,42.16 11.43,41.27 11.43,19.3 16.51,14.22 v19.05,14.22 41.66,14.22 v42.55,13.34
  other vias: 46.35,13.34 46.35,10.79 44.45,10.79 44.45,12.06 44.45,13.34 42.55,10.79 42.55,9.53 44.45,9.53 46.35,9.53 48.26,9.53 48.26,10.79 48.26,12.06 49.53,10.79 49.53,9.53 49.53,12.06 48.26,13.34 46.35,12.06
  pour Top (isolate 0.406, rank 5): -12.7,6.35 -9.53,6.35 -9.53,4.45 -12.7,4.45
  pour Bottom (isolate 0.305, rank 2): 39.75,15.24 50.55,15.24 50.55,8.89 39.75,8.89
  pour Top (isolate 0.305, rank 2): 41.66,15.24 50.55,15.24 50.55,8.89 41.66,8.89
VCC_UART
  Top 0.406: ISP.6 35.31,46.35 D1.+
  Bottom 0.406: J1.5 45.72,4.32 52.58,4.32 55.12,6.86 55.12,51.31 52.45,53.98 45.72,53.98 J3.5 42.42,53.47 38.1,53.47 37.47,52.83 37.47,50.16 33.66,46.35 ISP.6
VCC_WIRE  (via drill 0.38)
  Top 1.27: 11.56,7.24 12.83,8.51 17.4,8.51 20.32,11.43 TER_VIN_JST.A
  other vias: 6.99,52.07 8.26,52.7 5.71,51.44 4.45,50.8 3.17,50.16 8.26,6.99 6.99,7.62 5.71,8.26 4.45,8.89 3.17,9.53
  pour Top (isolate 0.406, rank 2): 13.34,59.69 13.34,51.44 12.7,50.8 5.98,50.8 5.08,49.9 5.08,10.16 6.35,8.89 12.7,8.89 13.34,8.26 13.34,0 0,0 0,59.69
  pour Bottom (isolate 0.406, rank 2): 13.34,59.69 0,59.69 0,0 13.34,0 13.34,8.26 12.7,8.89 6.35,8.89 5.08,10.16 5.08,49.9 5.98,50.8 12.7,50.8 13.34,51.44
XTAL1
  Top 0.406: U1.7 22.83,22.38 X1.1
XTAL2
  Top 0.406: U1.8 23.63,25.52 24.51,24.64 25.65,24.64 26.42,23.88 X1.3

### Text on the board
Top: top layer
Bottom: bottom layer
Dimension: boardoutline
tPlace: silktop | DTR | GND | TXD | RXD | VCC | GND | SCL | SDA | VCC | GND | 1 | 1 | 1 | VCC | 4 | BLUE | 1 | 8 | 1 | GREEN | 8 | RED | 5 | VCC | 8 | 8 | VCC | GND | DTR | GND | TXD | RXD | VCC | GND | SCL | SDA
bPlace: silkbottom | DTR | GND | TXD | RXD | VCC | GND | SCL | SDA | VCC | VCC | GND | GND | AREF | ADC7 | ADC6 | PD2 | Rainbowduino | V2.0 by SeeedStudio | 10/31/09 | www.seeedstudio.com | VCC | VCC | GND | GND | DTR | GND | TXD | RXD | VCC | GND | SCL | SDA
tValues: 1
tStop: solder paste top
bStop: solder paste bottom
tCream: pad paste top
bCream: pad paste bottom
Drills: drill
Reference: 1 | 1 | VCC | 4 | BLUE | 1 | 8 | 1 | GREEN | 8 | RED | 5 | VCC | 8 | 8
blue: Blue soldermask bottom
green: Green soldermask buttom
red: Red soldermask buttom